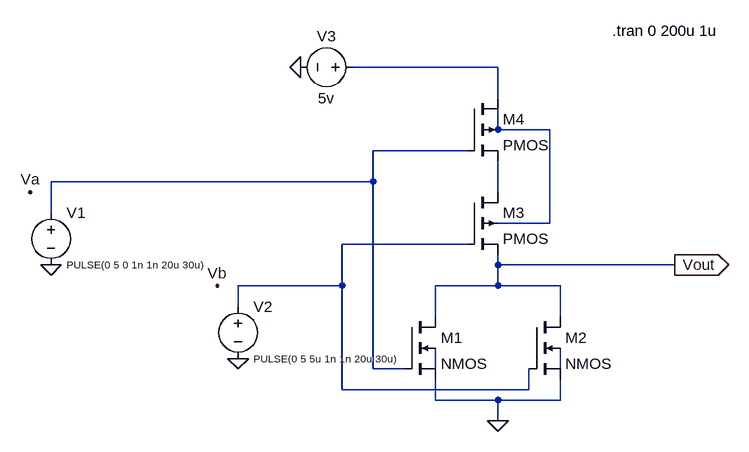
[diagram p0: schematic NOR gate 2ip.asc]
NOR gate 2ip.asc, the LTspice schematic file:
Version 4
SHEET 1 880 680
WIRE 400 -176 176 -176
WIRE 400 -128 400 -176
WIRE 400 -80 400 -112
WIRE 480 -80 400 -80
WIRE 352 -48 208 -48
WIRE 208 0 208 -48
WIRE 208 0 -288 0
WIRE 400 16 400 -32
WIRE -288 48 -288 0
WIRE 480 64 480 -80
WIRE 480 64 400 64
WIRE 352 96 160 96
WIRE 400 128 400 112
WIRE 672 128 400 128
WIRE 160 160 160 96
WIRE 160 160 0 160
WIRE 400 160 400 128
WIRE 400 160 304 160
WIRE 496 160 400 160
WIRE 0 192 0 160
WIRE 304 208 304 160
WIRE 496 208 496 160
WIRE 208 288 208 0
WIRE 256 288 208 288
WIRE 304 288 304 256
WIRE 496 288 496 256
WIRE 160 320 160 160
WIRE 448 320 448 288
WIRE 448 320 160 320
WIRE 304 336 304 304
WIRE 400 336 304 336
WIRE 496 336 496 304
WIRE 496 336 400 336
WIRE 400 368 400 336
FLAG 400 368 0
FLAG 96 -176 0
FLAG -288 128 0
FLAG 0 272 0
FLAG -320 16 Va
FLAG -32 160 Vb
FLAG 672 128 Vout
IOPIN 672 128 Out
SYMBOL nmos4 256 208 R0
SYMATTR InstName M1
SYMBOL nmos4 448 208 R0
SYMATTR InstName M2
SYMBOL pmos4 352 16 R0
SYMATTR InstName M3
SYMBOL pmos4 352 -128 R0
SYMATTR InstName M4
SYMBOL voltage -288 32 R0
WINDOW 3 24 96 Left 1
WINDOW 123 0 0 Left 0
WINDOW 39 0 0 Left 0
SYMATTR InstName V1
SYMATTR Value PULSE(0 5 0 1n 1n 20u 30u)
SYMBOL voltage 0 176 R0
WINDOW 3 24 96 Left 1
WINDOW 123 0 0 Left 0
WINDOW 39 0 0 Left 0
SYMATTR InstName V2
SYMATTR Value PULSE(0 5 5u 1n 1n 20u 30u)
SYMBOL voltage 192 -176 R90
WINDOW 0 -32 56 VBottom 2
WINDOW 3 32 56 VTop 2
WINDOW 123 0 0 Left 0
WINDOW 39 0 0 Left 0
SYMATTR InstName V3
SYMATTR Value 5v
TEXT 576 -232 Left 2 !.tran 0 200u 1u

The netlist it stands for:
* NOR gate 2ip.asc
M1 Vout N003 0 N006 NMOS
M2 Vout N005 0 N007 NMOS
M3 N004 N005 Vout N002 PMOS
M4 N001 N003 N004 N002 PMOS
V1 N003 0 PULSE(0 5 0 1n 1n 20u 30u)
V2 N005 0 PULSE(0 5 5u 1n 1n 20u 30u)
V3 N001 0 5v
.model NMOS NMOS
.model PMOS PMOS
.lib standard.mos
.tran 0 200u 1u
.backanno
.end